# Altium schematic sheet main.SchDoc
size A4; SheetNumber: 1; SheetTotal: 12
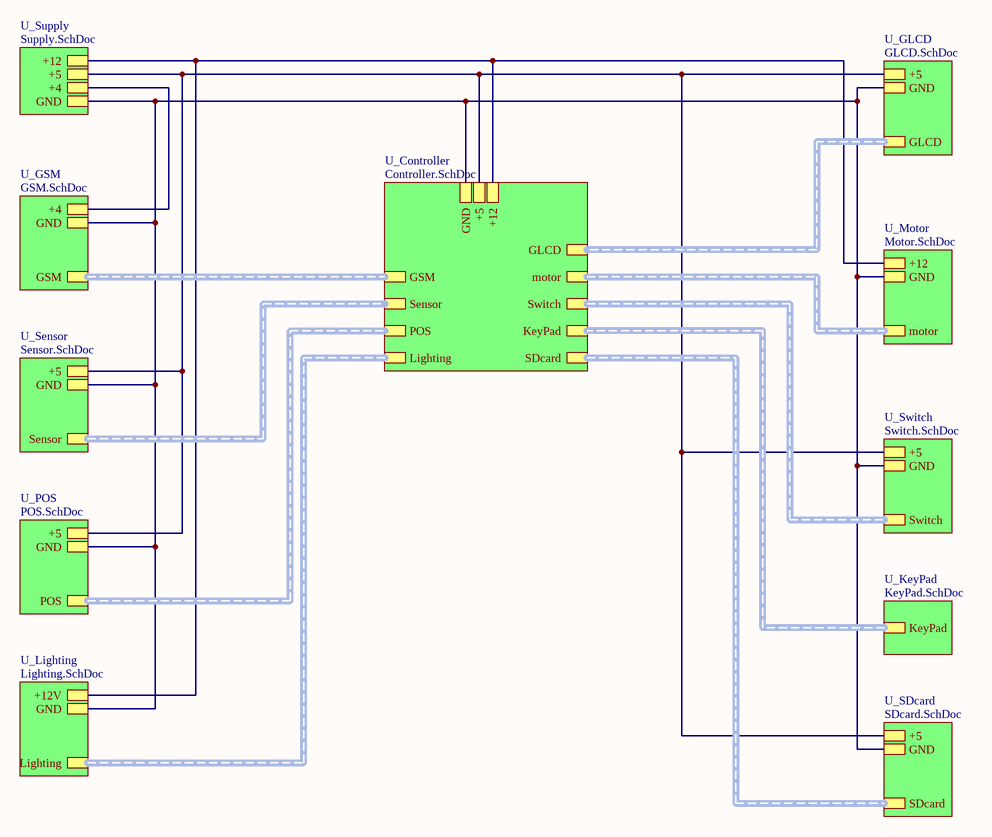
[diagram p0: main.SchDoc]

## Sub-sheets
U_Controller = Controller.SchDoc: GSM (harness GSM), motor (harness motor), Switch (harness Switch), GLCD (harness GLCD), +12, +5, GND, Sensor (harness Sensor), KeyPad (harness KeyPad), SDcard (harness SDcard), Lighting (harness Lighting), POS (harness POS)
U_GLCD = GLCD.SchDoc: +5, GLCD (harness GLCD), GND
U_GSM = GSM.SchDoc: +4, GND, GSM (harness GSM)
U_KeyPad = KeyPad.SchDoc: KeyPad (harness KeyPad)
U_Lighting = Lighting.SchDoc: +12V, GND, Lighting (harness Lighting)
U_Motor = Motor.SchDoc: motor (harness motor), +12, GND
U_POS = POS.SchDoc: POS (harness POS), +5, GND
U_SDcard = SDcard.SchDoc: +5, GND, SDcard (harness SDcard)
U_Sensor = Sensor.SchDoc: +5, GND, Sensor (harness Sensor)
U_Supply = Supply.SchDoc: GND, +4, +5, +12
U_Switch = Switch.SchDoc: +5, GND, Switch (harness Switch)

## Nets
(unnamed): sheet U_GLCD/+5, sheet U_Controller/+5, sheet U_POS/+5, sheet U_Sensor/+5, sheet U_Supply/+5, sheet U_Switch/+5, sheet U_SDcard/+5
(unnamed): sheet U_GLCD/GND, sheet U_Controller/GND, sheet U_GSM/GND, sheet U_Motor/GND, sheet U_POS/GND, sheet U_Sensor/GND, sheet U_Supply/GND, sheet U_Switch/GND, sheet U_SDcard/GND, sheet U_Lighting/GND
(unnamed): sheet U_Controller/+12, sheet U_Motor/+12, sheet U_Supply/+12, sheet U_Lighting/+12V
(unnamed): sheet U_GSM/+4, sheet U_Supply/+4

## Buses and harness runs
harness sheet U_Controller/GLCD = sheet U_GLCD/GLCD
harness sheet U_Controller/GSM = sheet U_GSM/GSM
harness sheet U_Controller/KeyPad = sheet U_KeyPad/KeyPad
harness sheet U_Controller/Lighting = sheet U_Lighting/Lighting
harness sheet U_Controller/motor = sheet U_Motor/motor
harness sheet U_Controller/POS = sheet U_POS/POS
harness sheet U_Controller/SDcard = sheet U_SDcard/SDcard
harness sheet U_Controller/Sensor = sheet U_Sensor/Sensor
harness sheet U_Controller/Switch = sheet U_Switch/Switch